# Altium project Blinker.PrjPcb
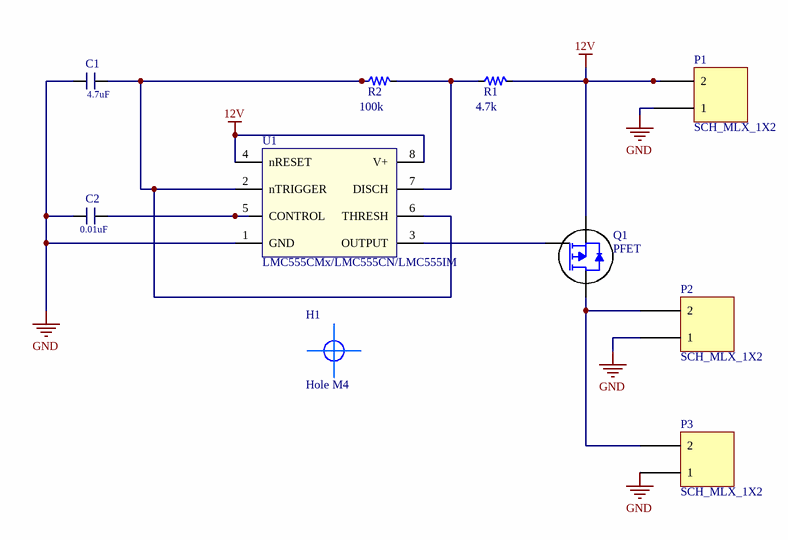
[diagram p0: Blinker.SchDoc]
1 sheet, 10 parts. Net scope: global (net labels, ports and power ports of the same name join across sheets).
Board files: BlinkerInline.PcbDoc, SolarLogo.PcbDoc

## Sheet Blinker.SchDoc
size Letter

### Parts
C1  Capacitance: 4.7uF  [PCB_GENERIC_SMD_0603]  (hidden comment: SCH_GENERIC_CAPACITOR_0603)
C2  Capacitance: 0.01uF  [PCB_GENERIC_SMD_0603]  (hidden comment: SCH_GENERIC_CAPACITOR_0603)
H1  Hole M4  [#10Hole]
P1  SCH_MLX_1X2  [PCB_MLX_MICROFIT_1X2]
P2  SCH_MLX_1X2  [PCB_MLX_MICROFIT_1X2]
P3  SCH_MLX_1X2  [PCB_MLX_MICROFIT_1X2]
Q1  PFET  [SOT23F]
R1  Resistance: 4.7k  [PCB_GENERIC_SMD_0603]  (hidden comment: SCH_GENERIC_RESISTOR_0603)
R2  Resistance: 100k  [PCB_GENERIC_SMD_0603]  (hidden comment: SCH_GENERIC_RESISTOR_0603)
U1  LMC555CMx/LMC555CN/LMC555IM  [D-8]

### Nets
12V: P1.2 Q1.2(S) R1.2 U1.4(nRESET) U1.8(V+)
GND: C1.1 C2.1 P1.1 P2.1 P3.1 U1.1(GND)
NetC1_2: C1.2 R2.1 U1.2(nTRIGGER) U1.6(THRESH)
NetC2_2: C2.2 U1.5(CONTROL)
NetP2_2: P2.2 P3.2 Q1.3(D)
NetQ1_1: Q1.1(G) U1.3(OUTPUT)
NetR1_1: R1.1 R2.2 U1.7(DISCH)

### Library data of the parts
C1 C2 = SCH_GENERIC_CAPACITOR_0603: Generic SMD capacitor 0603; Tolerance: *%
H1 = #10Hole
Q1 = PFET: MOSFET P CH 30V 6A 2-3Z1A
R1 R2 = SCH_GENERIC_RESISTOR_0603: Generic SMD resistor 0603
  R2: Parameter 1: *
U1 = LMC555CMx/LMC555CN/LMC555IM: 555 Type, Timer/Oscillator (Single) IC 3MHz 8-SOIC; Part Number: LMC555CMX/NOPB; Manufacturer: Texas Instruments